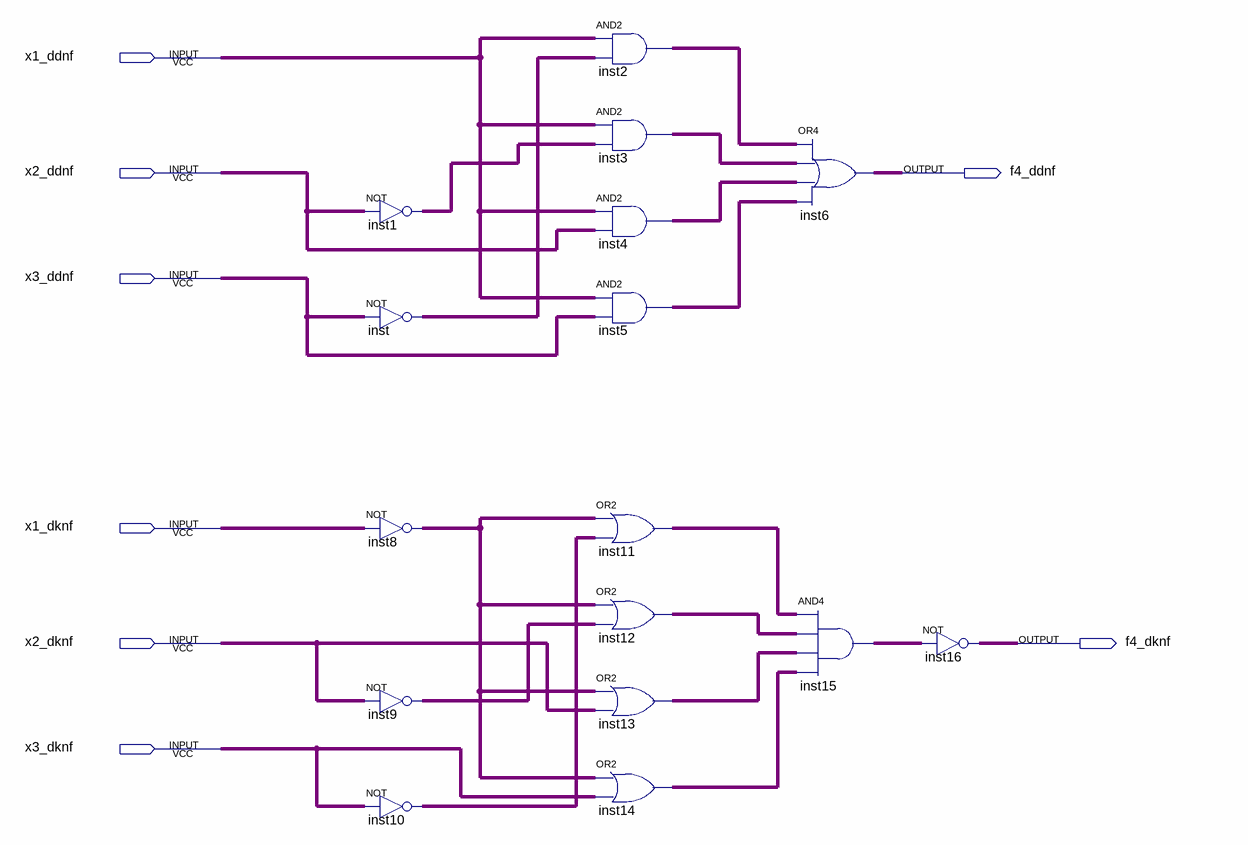
[diagram p0: schematic sheet]
// Quartus schematic KS_Lab1.bdf as structural Verilog: 16 symbols, 8 pins
module KS_Lab1 (
  input  x1_ddnf,
  input  x2_ddnf,
  input  x3_ddnf,
  input  x1_dknf,
  input  x2_dknf,
  input  x3_dknf,
  output f4_ddnf,
  output f4_dknf
);

  wire inst1_out, inst2_out, inst3_out, inst4_out, inst5_out, inst8_out, inst9_out, inst10_out, inst11_out,
       inst12_out, inst13_out, inst14_out, inst15_out, inst_out;

  not inst1 (inst1_out, x2_ddnf);
  not inst (inst_out, x3_ddnf);
  not inst8 (inst8_out, x1_dknf);
  not inst9 (inst9_out, x2_dknf);
  not inst10 (inst10_out, x3_dknf);
  and inst2 (inst2_out, x1_ddnf, inst_out);
  and inst3 (inst3_out, x1_ddnf, inst1_out);
  and inst4 (inst4_out, x1_ddnf, x2_ddnf);
  and inst5 (inst5_out, x1_ddnf, x3_ddnf);
  or inst11 (inst11_out, inst8_out, inst10_out);
  or inst12 (inst12_out, inst8_out, inst9_out);
  or inst13 (inst13_out, inst8_out, x2_dknf);
  or inst14 (inst14_out, inst8_out, x3_dknf);
  or inst6 (f4_ddnf, inst2_out, inst3_out, inst4_out, inst5_out);
  and inst15 (inst15_out, inst11_out, inst12_out, inst13_out, inst14_out);
  not inst16 (f4_dknf, inst15_out);
endmodule
